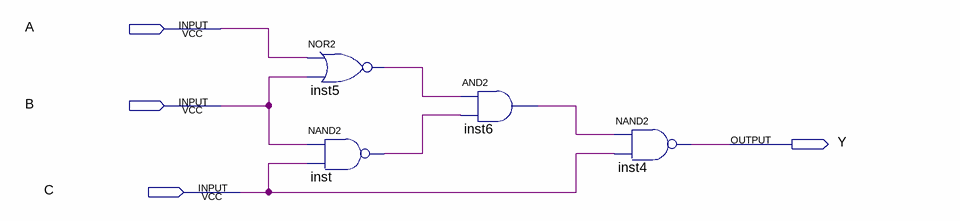
[diagram p0: schematic sheet]
// Quartus schematic Tutorial_1_Gudmundsson.bdf as structural Verilog: 4 symbols, 4 pins
module Tutorial_1_Gudmundsson (
  input  A,
  input  B,
  input  C,
  output Y
);

  wire inst5_out, inst6_out, inst_out;

  nor inst5 (inst5_out, A, B);
  nand inst (inst_out, B, C);
  and inst6 (inst6_out, inst5_out, inst_out);
  nand inst4 (Y, inst6_out, C);
endmodule
